# Altium schematic sheet VBAT_Outputs.SchDoc: VBAT Outputs
size A4; DrawnBy: Samyar Sadat Akhavi; Revision: 1.0; SheetNumber: 7; SheetTotal: 14
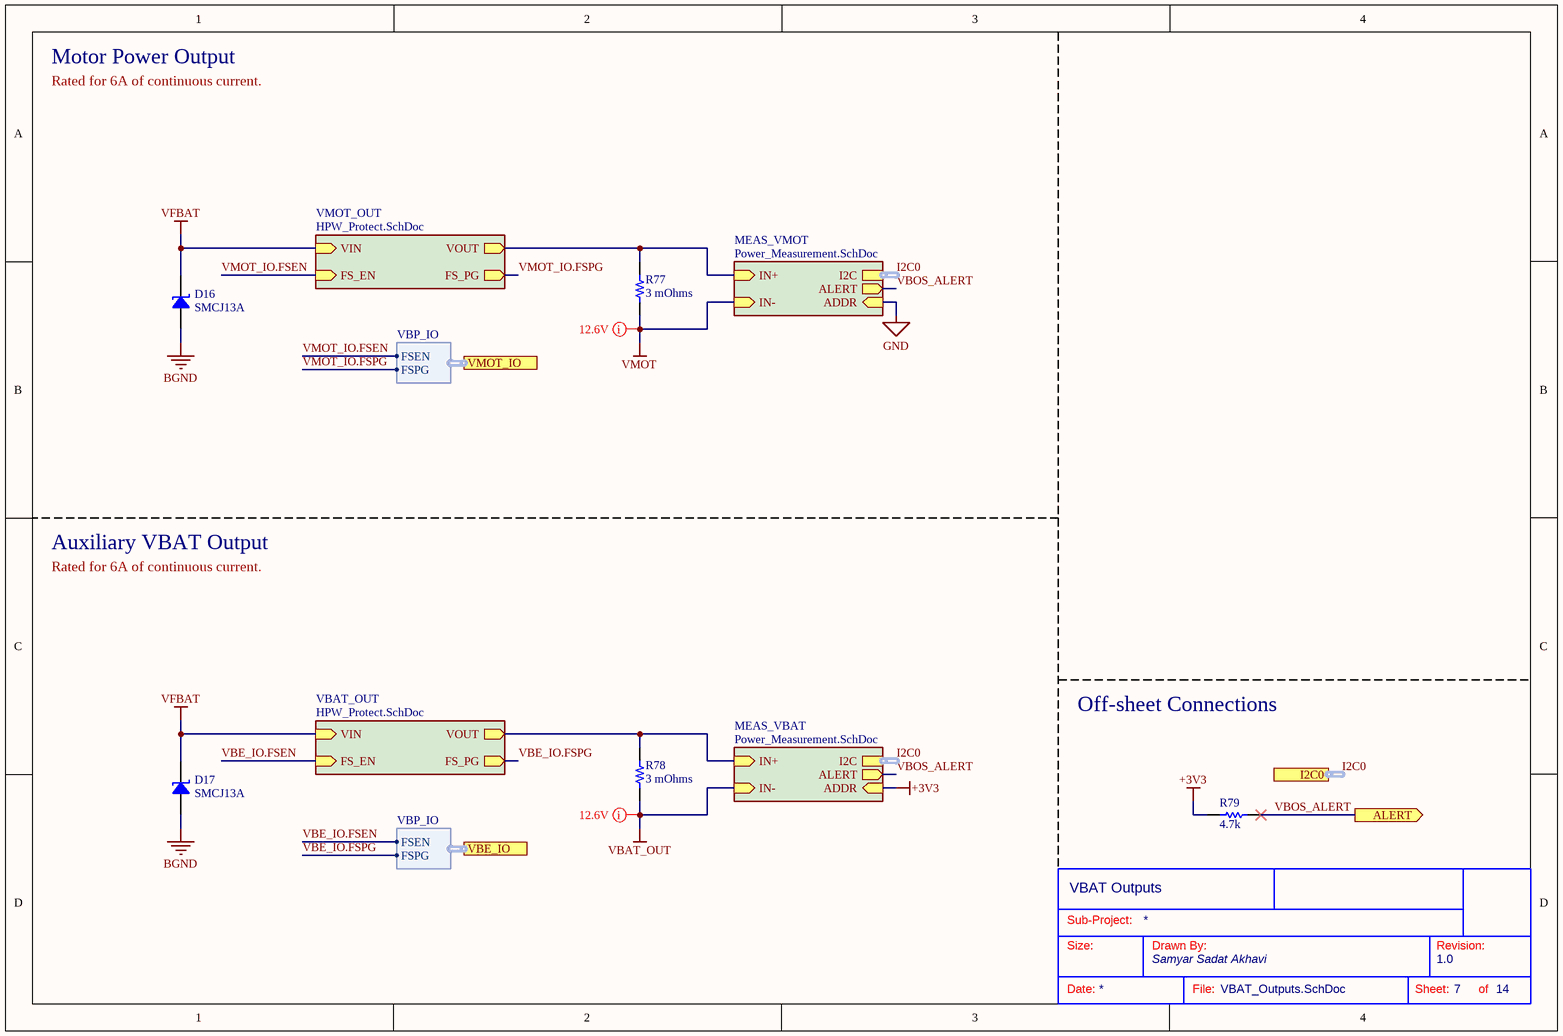
[diagram p0: VBAT_Outputs.SchDoc]

## Parts
?  (no value)  (graphical)
D16  SMCJ13A  [DO214AB SMC]
D17  SMCJ13A  [DO214AB SMC]
R77  3 mOhms  [RES 2512_6432]
R78  3 mOhms  [RES 2512_6432]
R79  4.7k  [RES_0603]

## Sub-sheets
MEAS_VBAT = Power_Measurement.SchDoc: I2C (harness I2C), ALERT (out), ADDR (in), IN+ (in), IN- (in)
MEAS_VMOT = Power_Measurement.SchDoc: I2C (harness I2C), ALERT (out), ADDR (in), IN+ (in), IN- (in)
VBAT_OUT = HPW_Protect.SchDoc: FS_PG (out), FS_EN (in), VIN (in), VOUT (out)
VMOT_OUT = HPW_Protect.SchDoc: FS_PG (out), FS_EN (in), VIN (in), VOUT (out)

## Ports
ALERT (out, see Power_Board[3B], Power_Measurement[3B]), I2C0 (harness I2C, see Power_Board[3B], Battery_Input[5A], Microcontroller[5C]), VBE_IO (harness VBP_IO, see Power_Board[3B], Microcontroller[4B]), VMOT_IO (harness VBP_IO, see Power_Board[3A], Microcontroller[4B])

## Harnesses
VBP_IO: FSEN, FSPG

## Nets
+3V3: R79.2 ; sheet MEAS_VBAT/ADDR
BGND: D16.1 D17.1
GND: sheet MEAS_VMOT/ADDR
VBAT_OUT: R78.1 ; sheet MEAS_VBAT/IN-
VFBAT: D16.2 D17.2 ; sheet VMOT_OUT/VIN, sheet VBAT_OUT/VIN
VMOT: R77.1 ; sheet MEAS_VMOT/IN-
VBE_IO.FSEN: sheet VBAT_OUT/FS_EN, port VBE_IO.FSEN
VBE_IO.FSPG: sheet VBAT_OUT/FS_PG, port VBE_IO.FSPG
VBOS_ALERT: R79.1 ; port ALERT, sheet MEAS_VMOT/ALERT, sheet MEAS_VBAT/ALERT
VMOT_IO.FSEN: sheet VMOT_OUT/FS_EN, port VMOT_IO.FSEN
VMOT_IO.FSPG: sheet VMOT_OUT/FS_PG, port VMOT_IO.FSPG
NetR77_2: R77.2 ; sheet VMOT_OUT/VOUT, sheet MEAS_VMOT/IN+
NetR78_2: R78.2 ; sheet MEAS_VBAT/IN+, sheet VBAT_OUT/VOUT

## Buses and harness runs
harness I2C0 = port I2C0
harness I2C0 = sheet MEAS_VBAT/I2C
harness I2C0 = sheet MEAS_VMOT/I2C

## Layout directives
rule Supply Nets [Voltage = 12.60]: VBAT_OUT, VMOT

## Notes on the sheet
- Motor Power Output
- Rated for 6A of continuous current.
- Auxiliary VBAT Output
- Off-sheet Connections
- Sub-Project:
- Size:
- Drawn By:
- Revision:
- Date:
- File:
- Sheet:
- of

## Library data of the parts
? = Standard Title Block
D16 D17 = SMCJ13A: TVS DIODE 13VWM 21.5VC DO214AB; Manufacturer: Littelfuse Inc.; Current - Peak Pulse (10/1000µs): 69.8A; Power Line Protection: No; Power - Peak Pulse: 1500W (1.5kW); Type: Zener; Unidirectional Channels: 1; Voltage - Breakdown (Min): 14.4V; Voltage - Clamping (Max) @ Ipp: 21.5V; Voltage - Reverse Standoff (Typ): 13V; Part Number: SMCJ13A; Applications: General Purpose; ComponentLink1Description: Datasheet; ComponentLink1URL: https://www.littelfuse.com/products/tvs-diodes/surface-mount/~/media/electronics/datasheets/tvs_diodes/littelfuse_tvs_diode_smcj_datasheet.pdf.pdf; ComponentLink2Description: DigiKey Link; ComponentLink2URL: https://www.digikey.com/en/products/detail/littelfuse-inc/SMCJ13A/762378; LastUpdated: 6/3/2024 7:57:05 PM; Lifecycle Status: Active; Minimum Order: 1; Mounting Type: Surface Mount; Operating Temperature: -55°C ~ 150°C (TJ); Package / Case: DO-214AB, SMC; Packaging: TapeAndReel; PartId: 6718; Part Status: Active; Price: 0.16; Series: SMCJ; Supplier 1: DigiKey; Supplier Part Number 1: SMCJ13ALFCT-ND; Supplier Device Package: DO-214AB (SMCJ)
R77 R78 = TLR3A20KR003FTDG: RES 0.003 OHM 1% 2W 2512; manufacturer: TE Connectivity Passive Product; Temperature Coefficient: ±150ppm/°C; Part Number: TLR3A20KR003FTDG; componentlink1description: Datasheet; componentlink1url: https://www.te.com/commerce/DocumentDelivery/DDEController?Action=srchrtrv&DocNm=1773449-3&DocType=DS&DocLang=English; componentlink2description: DigiKey Link; componentlink2url: http://digikey.com/product-detail/en/te-connectivity-passive-product/TLR3A20KR003FTDG/A131783CT-ND/8603913; Composition: Metal Foil; Device Package: 2512 (6432 Metric); Features: Current Sense; Height - Seated (Max): 0.024" (0.60mm); lastupdated: 9/2/2020 1:27:06 AM; Lifecycle Status: Active; Minimum Order: 1; Number of Terminations: 2; Operating Temperature: -55°C ~ 170°C; Package / Case: 2512 (6432 Metric); packaging: TapeAndReel; Part Status: Active; Power (Watts): 2W; price: 0.30; Resistance: 3 mOhms; series: TLR, CGS; Size / Dimension: 0.252" L x 0.126" W (6.40mm x 3.20mm); Supplier 1: DigiKey; Supplier Part Number 1: A131783CT-ND; Supplier Device Package: 2512; Tolerance: ±1%; value: 3 mOhms
R79 = Resistor: Power: 1/8W; Value: 4.7k